# EAGLE design schematic-version4 - Jingbin (EAGLE 8.6.0)
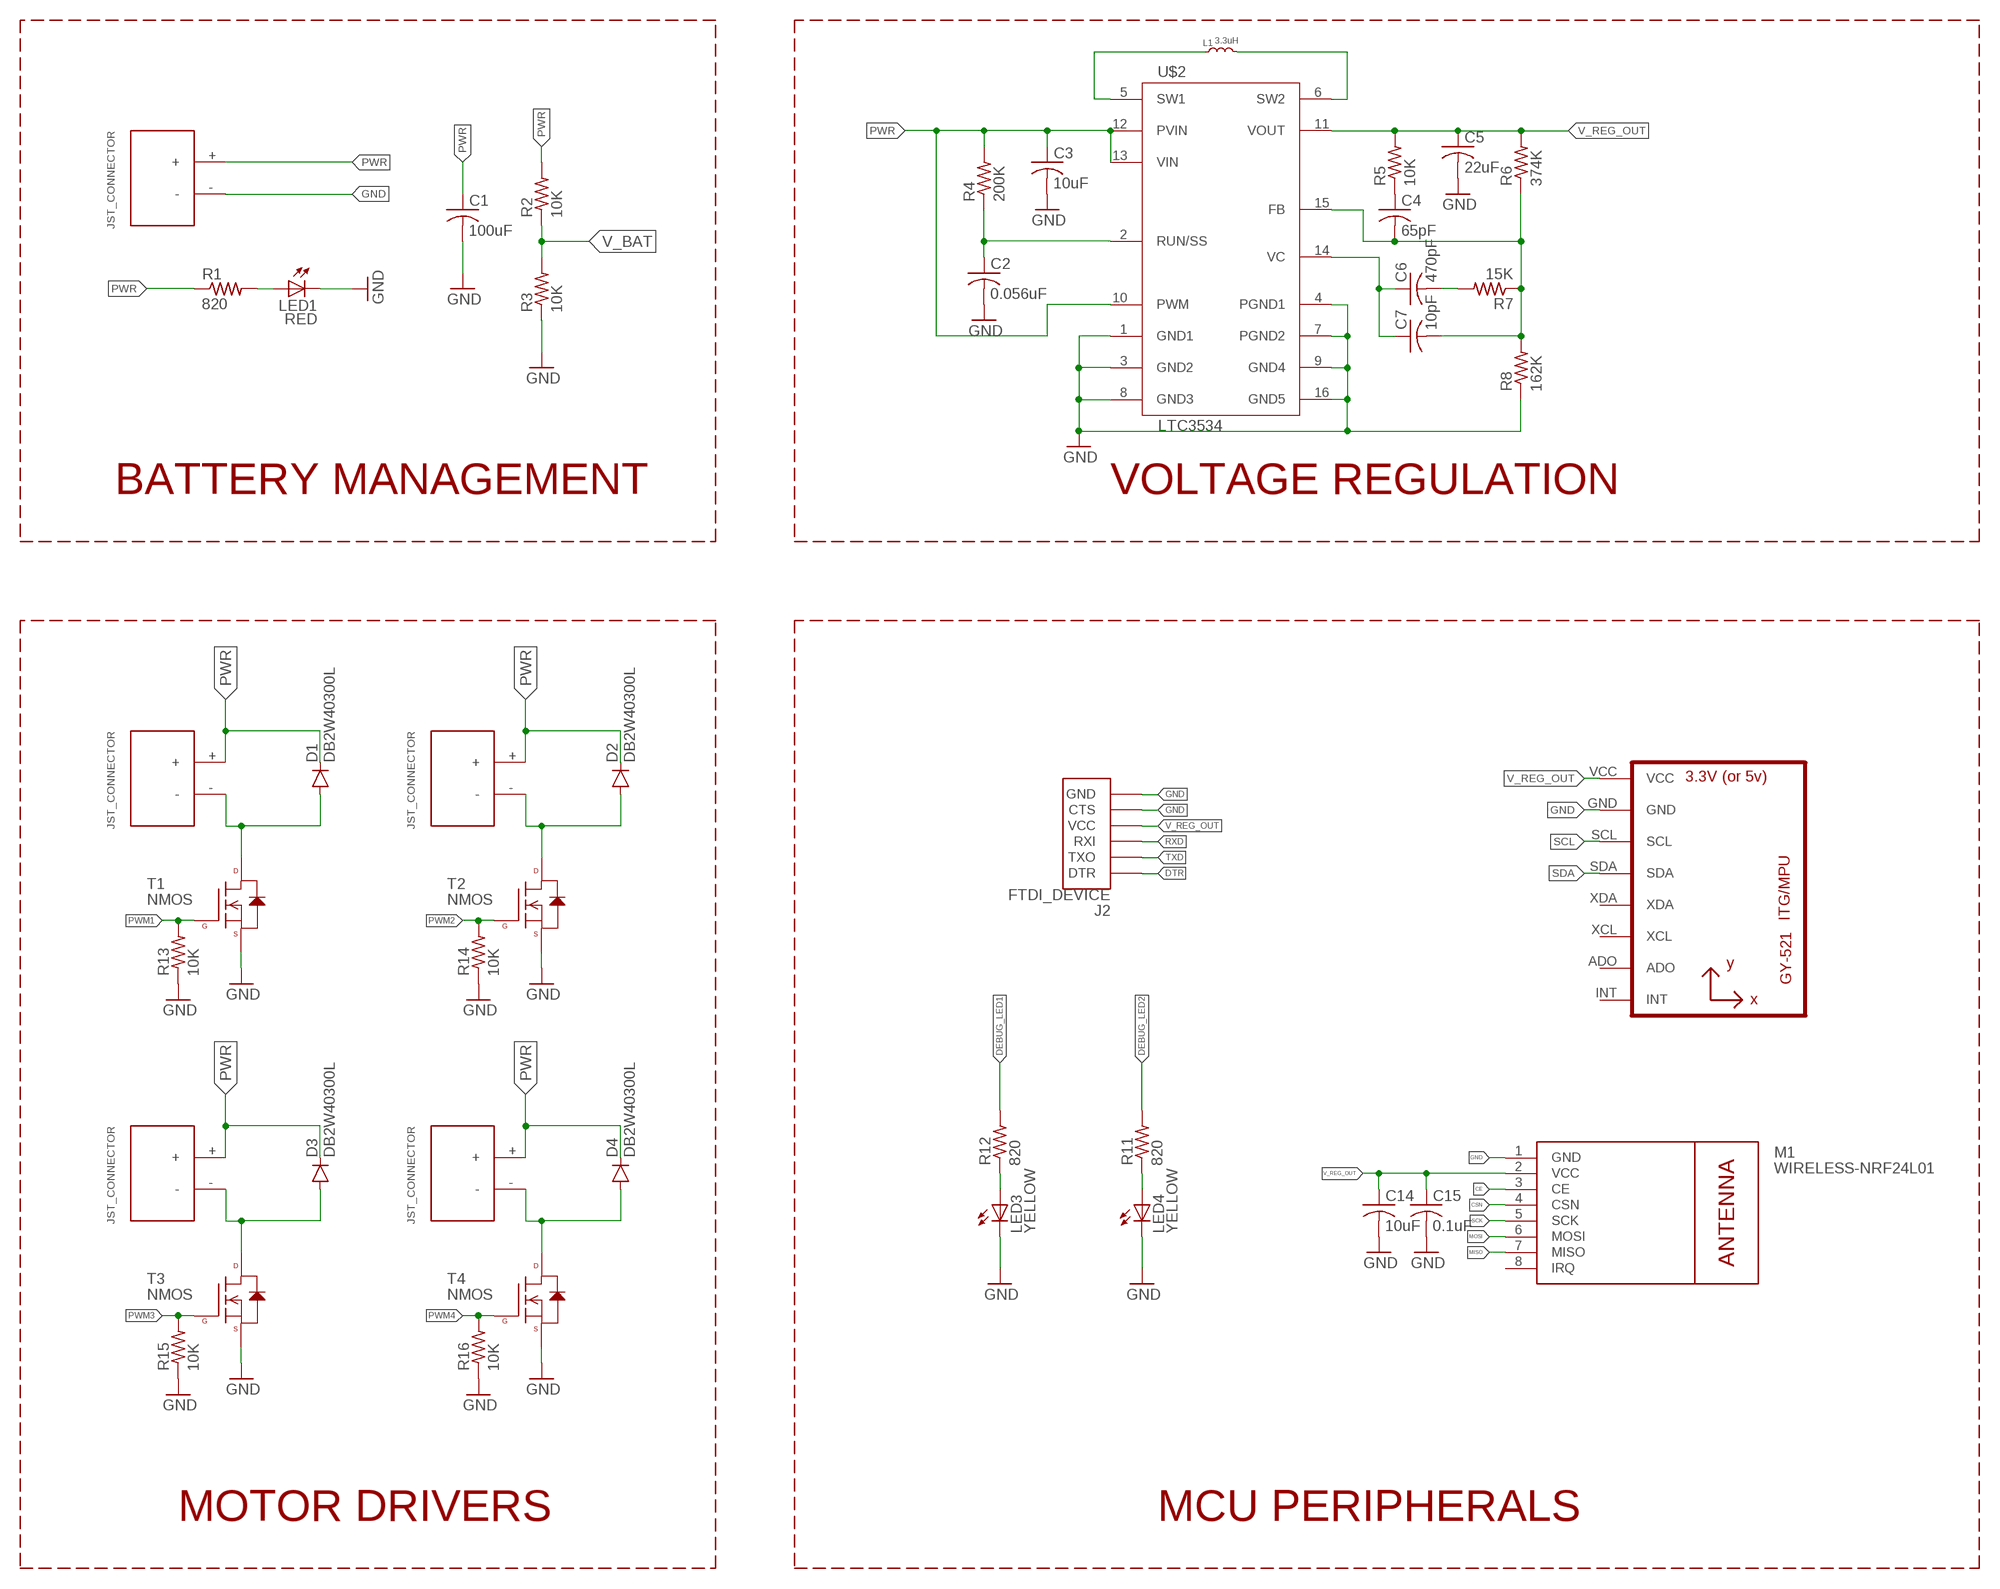
[diagram p0: schematic, sheet 1, part 1 of 2]
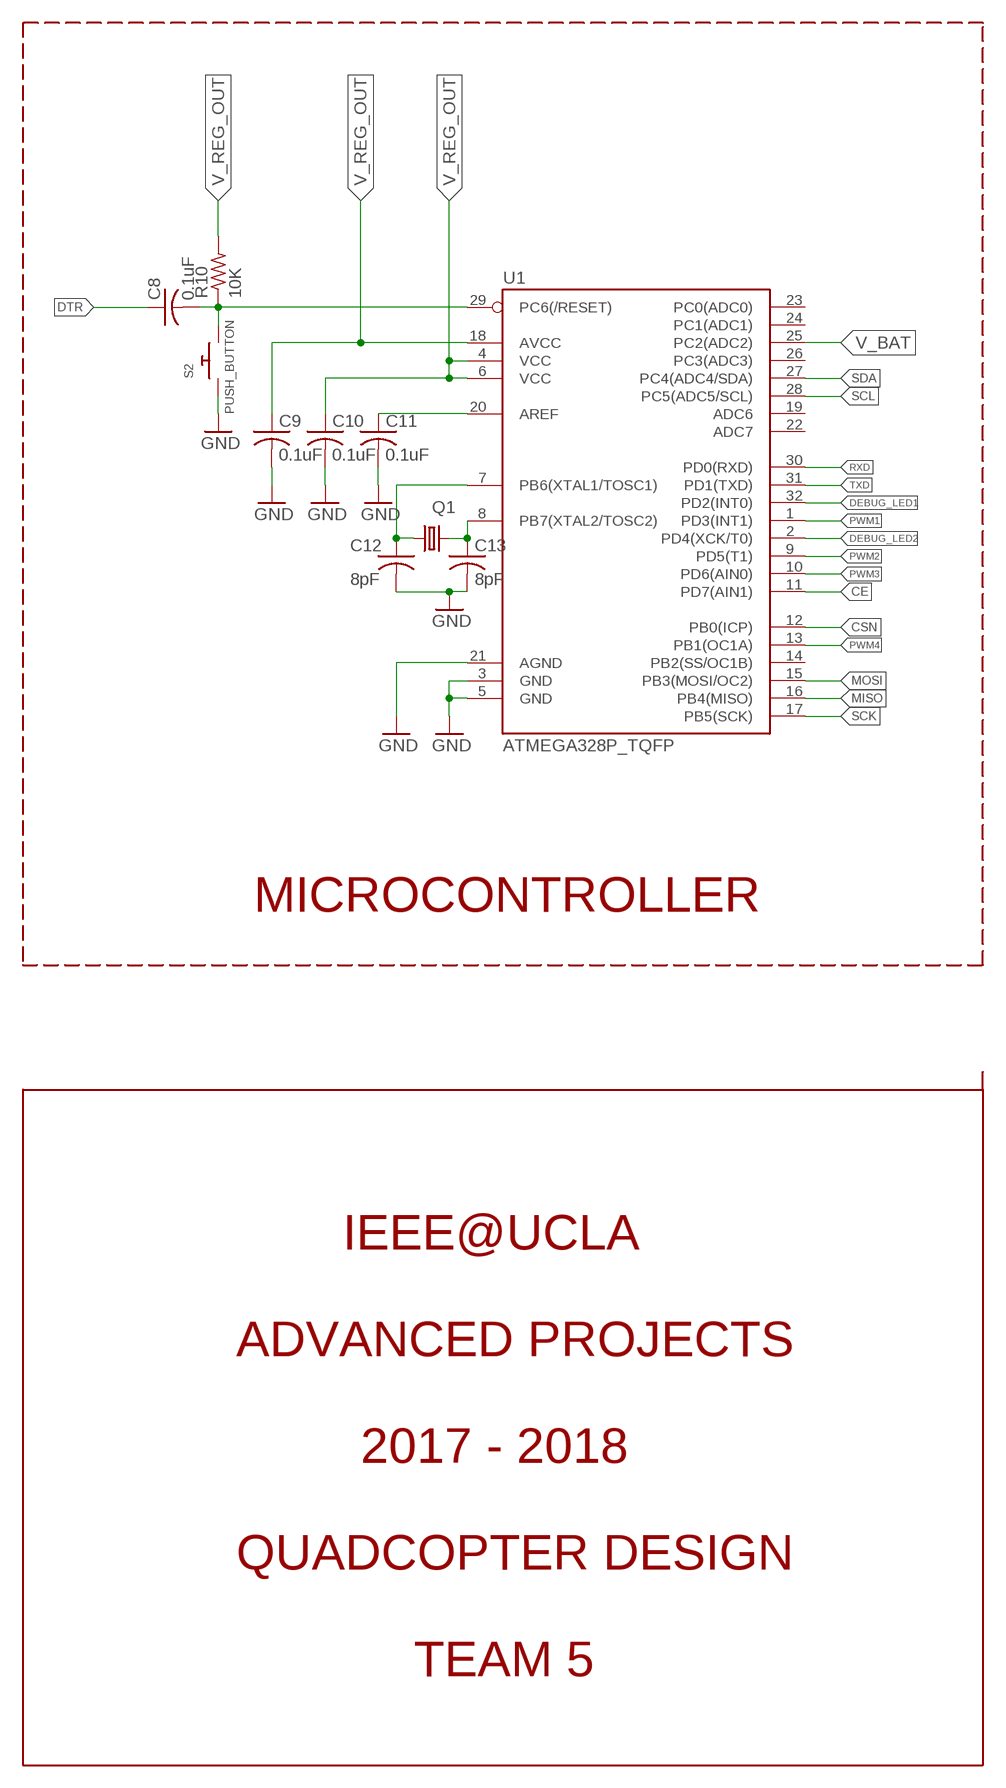
[diagram p1: schematic, sheet 1, part 2 of 2]

## Parts
C1  100uF  C-USC1206  [C1206]
C2  0.056uF  C-USC0603  [C0603]
C3  10uF  C-USC0603  [C0603]
C4  65pF  C-USC1206  [C1206]
C5  22uF  C-USC0603  [C0603]
C6  470pF  C-USC0603  [C0603]
C7  10pF  C-USC0603  [C0603]
C8  0.1uF  C-USC0603  [C0603]
C9  0.1uF  C-USC0603  [C0603]
C10  0.1uF  C-USC0603  [C0603]
C11  0.1uF  C-USC0603  [C0603]
C12  8pF  C-USC0603  [C0603]
C13  8pF  C-USC0603  [C0603]
C14  10uF  C-USC0603  [C0603]
C15  0.1uF  C-USC0603  [C0603]
D1  DB2W40300L  [MINI2-F3-B]
D2  DB2W40300L  [MINI2-F3-B]
D3  DB2W40300L  [MINI2-F3-B]
D4  DB2W40300L  [MINI2-F3-B]
J2  FTDI_DEVICE  [FTDI_DEVICE_SIDE]
L1  3.3uH  INDUCTOR.XAL4020  [XAL4020]
LED1  RED  LEDSML0603  [SML0603]
LED3  YELLOW  LEDSML0603  [SML0603]
LED4  YELLOW  LEDSML0603  [SML0603]
M1  WIRELESS-NRF24L01  [WIRELESS-NRF24L01]
Q1  NX3225GD  [NX3225GD-CRA-3]
R1  820  R-US_R0603  [R0603]
R2  10K  R-US_R0603  [R0603]
R3  10K  R-US_R0603  [R0603]
R4  200K  R-US_R0603  [R0603]
R5  10K  R-US_R0603  [R0603]
R6  374K  R-US_R0603  [R0603]
R7  15K  R-US_R0603  [R0603]
R8  162K  R-US_R0603  [R0603]
R10  10K  R-US_R0603  [R0603]
R11  820  R-US_R0603  [R0603]
R12  820  R-US_R0603  [R0603]
R13  10K  R-US_R0603  [R0603]
R14  10K  R-US_R0603  [R0603]
R15  10K  R-US_R0603  [R0603]
R16  10K  R-US_R0603  [R0603]
S2  PUSH_BUTTON  SWITCH_PUSHBUTTONSOFTTOUCHSMD_SJ  [PUSHBUTTON_SMD_SJ]
T1  NMOS  N-CHANNEL-MOSFET-IRLML6244TRPBF  [SOT23-3]
T2  NMOS  N-CHANNEL-MOSFET-IRLML6244TRPBF  [SOT23-3]
T3  NMOS  N-CHANNEL-MOSFET-IRLML6244TRPBF  [SOT23-3]
T4  NMOS  N-CHANNEL-MOSFET-IRLML6244TRPBF  [SOT23-3]
U1  ATMEGA328P_TQFP  [TQFP32-08]
U2  GY-521MPU6050  [GY-521]
U$1  JST_CONNECTOR_FEMALE  [JST_CONNECTOR_FEMALE]
U$2  LTC3534  [SSOP-16GN]
U$4  JST_CONNECTOR_FEMALE  [JST_CONNECTOR_FEMALE]
U$7  JST_CONNECTOR_FEMALE  [JST_CONNECTOR_FEMALE]
U$10  JST_CONNECTOR_FEMALE  [JST_CONNECTOR_FEMALE]
U$13  JST_CONNECTOR_FEMALE  [JST_CONNECTOR_FEMALE]

## Nets
CE: M1.3(CE) U1.11(PD7(AIN1))
CSN: M1.4(CSN) U1.12(PB0(ICP))
DEBUG_LED1: R12.2 U1.32(PD2(INT0))
DEBUG_LED2: R11.2 U1.2(PD4(XCK/T0))
DTR: C8.1 J2.P$1(DTR)
GND: C1.2 C2.2 C3.2 C5.2 C9.2 C10.2 C11.2 C12.2 C13.2 C14.2 C15.2 J2.P$5(CTS) J2.P$6(GND) LED1.C LED3.C LED4.C M1.1(GND) R3.1 R8.1 R13.1 R14.1 R15.1 R16.1 S2.P$1 T1.2(S) T2.2(S) T3.2(S) T4.2(S) U1.3(GND) U1.5(GND) U1.21(AGND) U2.GND U$1.- U$2.1(GND1) U$2.3(GND2) U$2.4(PGND1) U$2.7(PGND2) U$2.8(GND3) U$2.9(GND4) U$2.16(GND5)
MISO: M1.7(MISO) U1.16(PB4(MISO))
MOSI: M1.6(MOSI) U1.15(PB3(MOSI/OC2))
N$1: C12.1 Q1.P$1 U1.7(PB6(XTAL1/TOSC1))
N$2: C8.2 R10.1 S2.P$2 U1.29(PC6(/RESET))
N$3: D1.POS(PPIN) T1.3(D) U$4.-
N$4: C13.1 Q1.P$2 U1.8(PB7(XTAL2/TOSC2))
N$5: D2.POS(PPIN) T2.3(D) U$7.-
N$6: D3.POS(PPIN) T3.3(D) U$10.-
N$7: D4.POS(PPIN) T4.3(D) U$13.-
N$8: L1.1 U$2.5(SW1)
N$9: L1.2 U$2.6(SW2)
N$10: LED1.A R1.2
N$12: LED3.A R12.1
N$13: LED4.A R11.1
N$14: C4.1 R5.1
N$16: C2.1 R4.1 U$2.2(RUN/SS)
N$18: C4.2 C7.2 R6.1 R7.1 R8.2 U$2.15(FB)
N$19: C6.1 C7.1 U$2.14(VC)
N$20: C6.2 R7.2
N$25: C11.1 U1.20(AREF)
PWM1: R13.2 T1.1(G) U1.1(PD3(INT1))
PWM2: R14.2 T2.1(G) U1.9(PD5(T1))
PWM3: R15.2 T3.1(G) U1.10(PD6(AIN0))
PWM4: R16.2 T4.1(G) U1.13(PB1(OC1A))
PWR: C1.1 C3.1 D1.NEG(GPIN) D2.NEG(GPIN) D3.NEG(GPIN) D4.NEG(GPIN) R1.1 R2.2 R4.2 U$1.+ U$2.10(PWM) U$2.12(PVIN) U$2.13(VIN) U$4.+ U$7.+ U$10.+ U$13.+
RXD: J2.P$3(RXI) U1.30(PD0(RXD))
SCK: M1.5(SCK) U1.17(PB5(SCK))
SCL: U1.28(PC5(ADC5/SCL)) U2.SCL
SDA: U1.27(PC4(ADC4/SDA)) U2.SDA
TXD: J2.P$2(TXO) U1.31(PD1(TXD))
V_BAT: R2.1 R3.2 U1.25(PC2(ADC2))
V_REG_OUT: C5.1 C9.1 C10.1 C14.1 C15.1 J2.P$4(VCC) M1.2(VCC) R5.2 R6.2 R10.2 U1.4(VCC) U1.6(VCC) U1.18(AVCC) U2.VCC U$2.11(VOUT)
Unconnected: M1.8(IRQ) U1.14(PB2(SS/OC1B)) U1.19(ADC6) U1.22(ADC7) U1.23(PC0(ADC0)) U1.24(PC1(ADC1)) U1.26(PC3(ADC3)) U2.ADO U2.INT U2.XCL U2.XDA

## Notes on the sheet
- BATTERY MANAGEMENT | VOLTAGE REGULATION
- MICROCONTROLLER
- IEEE@UCLA
- ADVANCED PROJECTS
- 2017 - 2018
- QUADCOPTER DESIGN
- TEAM 5
- MOTOR DRIVERS | MCU PERIPHERALS

## Library data of the parts
C1 C4 C8-C11 = rcl:C-US: CAPACITOR, American symbol; SPICEPREFIX: C
C2 C3 C5-C7 C12-C15 = resistor:C-US: CAPACITOR, American symbol
D1-D4 = quad:DB2W40300L
J2 = quad:FTDI_DEVICE: Connector which mates to FTDI basic or FTDI cable.
L1 = coilcraft:INDUCTOR
LED1 LED3 LED4 = led:LED: LED OSRAM: - CHIPLED LG R971, LG N971, LY N971, LG Q971, LY Q971, LO R971, LY R971 LH N974, LH R974 LS Q976, LO Q976, LY Q976 LO Q996 - Hyper CHIPLED LW Q18S LB Q993, LB Q99A, LB R99A - SideLED LS A670, LO A670, LY A670, LG A670, LP A670 LB A673, LV A673, LT A673, LW A673 LH A674 LY A675 LS A676, LA A676, LO A676, LY A676, LW A676 LS A679, LY A679, LG A679 - Hyper Micro SIDELED® LS Y876, LA Y876, LO Y876, LY Y876 LT Y87S - SmartLED LW L88C, LW L88S LB L89C, LB L89S, LG L890 LS L89K, LO L89K, LY L89K LS L896, LA L896, LO L896, LY L896 - TOPLED LS T670, LO T670, LY T670, LG T670, LP T670 LSG T670, LSP T670, LSY T670, LOP T670, LYG T670 LG T671, LOG T671, LSG T671 LB T673, LV T673, LT T673, LW T673 LH T674 LS T676, LA T676, LO T676, LY T676, LB T676, LH T676, LSB T676, LW T676 LB T67C, LV T67C, LT T67C, LS T67K, LO T67K, LY T67K, LW E67C LS E67B, LA E67B, LO E67B, LY E67B, LB E67C, LV E67C, LT E67C LW T67C LS T679, LY T679, LG T679 LS T770, LO T770, LY T770, LG T770, LP T770 LB T773, LV T773, LT T773, LW T773 LH T774 LS E675, LA E675, LY E675, LS T675 LS T776, LA T776, LO T776, LY T776, LB T776 LHGB T686 LT T68C, LB T68C - Hyper Mini TOPLED® LB M676 - Mini TOPLED Santana® LG M470 LS M47K, LO M47K, LY M47K Source: http://www.osram.convergy.de LUXEON: - LUMILED® LXK2-PW12-R00, LXK2-PW12-S00, LXK2-PW14-U00, LXK2-PW14-V00 LXK2-PM12-R00, LXK2-PM12-S00, LXK2-PM14-U00 LXK2-PE12-Q00, LXK2-PE12-R00, LXK2-PE12-S00, LXK2-PE14-T00, LXK2-PE14-U00 LXK2-PB12-K00, LXK2-PB12-L00, LXK2-PB12-M00, LXK2-PB14-N00, LXK2-PB14-P00, LXK2-PB14-Q00 LXK2-PR12-L00, LXK2-PR12-M00, LXK2-PR14-Q00, LXK2-PR14-R00 LXK2-PD12-Q00, LXK2-PD12-R00, LXK2-PD12-S00 LXK2-PH12-R00, LXK2-PH12-S00 LXK2-PL12-P00, LXK2-PL12-Q00, LXK2-PL12-R00 Source: www.luxeon.com KINGBRIGHT: KA-3528ASYC Source: www.kingbright.com
M1 = quad:WIRELESS-NRF24L01: 2.4 GHz Wireless Module based on NRF24L01 chip
Q1 = NDK:NX3225GD
R1 R11 R12 = rcl:R-US_: RESISTOR, American symbol; SPICEPREFIX: R
R2-R8 R10 R13-R16 = resistor:R-US_: RESISTOR, American symbol
S2 = adafruit:SWITCH_PUSHBUTTON: Buttons SOFTTOUCHSMD_SJ - Soft touch temporary push button (Super Junk Akihabara) Compatible with SKPMANE010 [Mouser: 688-SKPMAN] C&K_KSS = Digikey: KSS221GLFS
T1-T4 = quad:N-CHANNEL-MOSFET: N-Channel MOSFET Mode Field Effect Transistor; DATASHEET: http://www.mouser.com/ds/2/196/irlml6244pbf-936666.pdf; MOUSER: 942-IRLML6244TRPBF; URL: http://www.mouser.com/Search/ProductDetail.aspx?R=IRLML6244TRPBFvirtualkey57370000virtualkey942-IRLML6244TRPBF
U1 = quad:ATMEGA328P_TQFP; PROD_ID: IC-09069
U2 = quad:GY-521
U$1 U$4 U$7 U$10 U$13 = quad:JST_CONNECTOR_FEMALE
U$2 = LTC3534:LTC3534

## Board
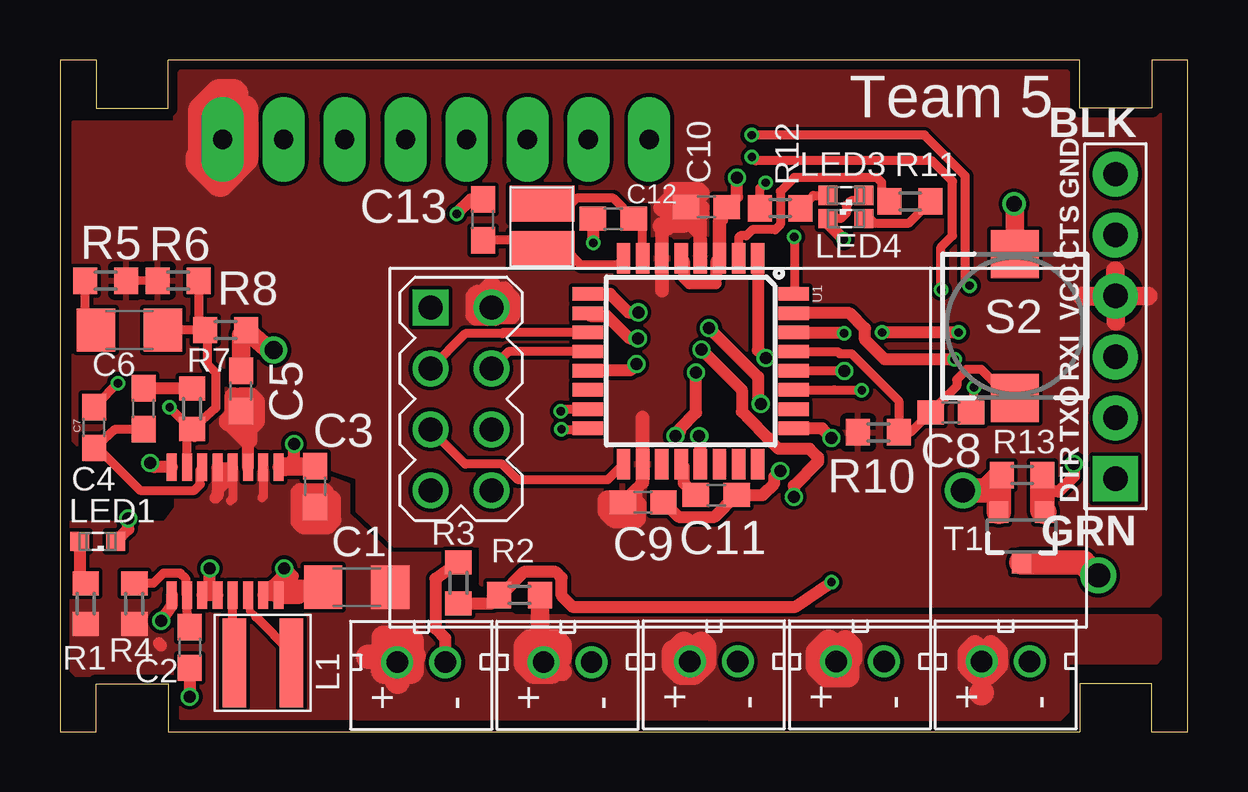
[diagram p2: board, top side]
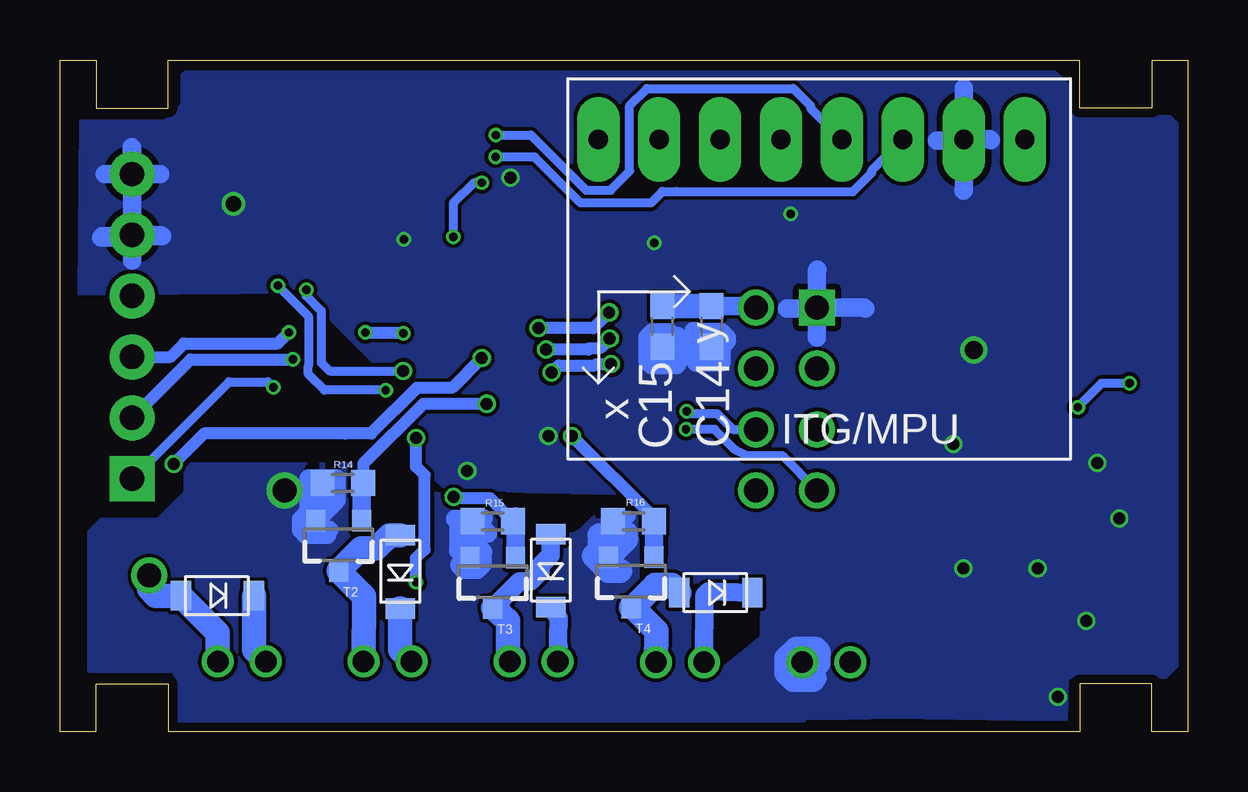
[diagram p3: board, bottom side, seen from below]

Size 47 x 28 mm. Coordinates in mm from the lower left corner, seen from the top.
Outline: 0,0 1.5,0 1.5,2 4.5,2 4.5,0 42.5,0 42.5,2 45.5,2 45.5,0 47,0 47,28 45.5,28 45.5,26 42.5,26 42.5,28 4.5,28 4.5,26 1.5,26 1.5,28 0,28 0,0
Copper layers (1*16): Top 0.035559375mm / dielectric 1.6mm / Bottom 0.035559375mm
Design rules "oshpark-2layer": minimum track width 6mil, minimum drill 10mil, track to track 6mil, track to pad 6mil, pad to pad 6mil, via to via 6mil, smd to smd 6mil, copper to edge 15mil, drill to drill 6mil, minimum pad ring 5mil, minimum via ring 5mil, stop-mask expansion 2.5mil, vias tented up to drill 0mil, thermal gap 10mil

### Footprints (pad centres in the part's own frame; a part is rotated, then mirrored left to right if it is on the bottom)
C1206 = smd 1.6 x 1.8: 1 -1.4,0; 2 1.4,0
C0603 = smd 1.1 x 1: 1 -0.85,0; 2 0.85,0
MINI2-F3-B = smd 1.22 x 0.85: NEG 0,1.55; POS 0,-1.5
FTDI_DEVICE_SIDE = drill 1.016 pad 1.88 square: P$1 -6.35,0 | drill 1.016 pad 1.88: P$2 -3.81,0; P$3 -1.27,0; P$4 1.27,0; P$5 3.81,0; P$6 6.35,0
XAL4020 = smd 0.98 x 3.7: 1 -1.185,0; 2 1.185,0
SML0603 = smd 0.8 x 0.8: A 0.75,0; C -0.75,0
WIRELESS-NRF24L01 = drill 1 square: 1 -12.7,6.35 | drill 1: 2 -10.16,6.35; 3 -12.7,3.81; 4 -10.16,3.81; 5 -12.7,1.27; 6 -10.16,1.27; 7 -12.7,-1.27; 8 -10.16,-1.27
NX3225GD-CRA-3 = smd 1.5 x 2.7: P$1 0.95,0; P$2 -0.95,0
R0603 = smd 1 x 1.1: 1 -0.85,0; 2 0.85,0
PUSHBUTTON_SMD_SJ = smd 2 x 2: P$1 3,0; P$2 -3,0
SOT23-3 = smd 0.8 x 0.9: 1 -0.95,-1; 2 0.95,-1; 3 0,1.1
TQFP32-08 = smd 1.27 x 0.559: 1 -4.293,2.8; 2 -4.293,2; 3 -4.293,1.2; 4 -4.293,0.4; 5 -4.293,-0.4; 6 -4.293,-1.2; 7 -4.293,-2; 8 -4.293,-2.8; 17 4.293,-2.8; 18 4.293,-2; 19 4.293,-1.2; 20 4.293,-0.4; 21 4.293,0.4; 22 4.293,1.2; 23 4.293,2; 24 4.293,2.8 | smd 0.559 x 1.27: 9 -2.8,-4.293; 10 -2,-4.293; 11 -1.2,-4.293; 12 -0.4,-4.293; 13 0.4,-4.293; 14 1.2,-4.293; 15 2,-4.293; 16 2.8,-4.293; 25 2.8,4.293; 26 2,4.293; 27 1.2,4.293; 28 0.4,4.293; 29 -0.4,4.293; 30 -1.2,4.293; 31 -2,4.293; 32 -2.8,4.293
GY-521 = drill 0.8 pad 1.778 long: ADO -8.89,-6.35; GND -8.89,6.35; INT -8.89,-8.89; SCL -8.89,3.81; SDA -8.89,1.27; VCC -8.89,8.89; XCL -8.89,-3.81; XDA -8.89,-1.27
JST_CONNECTOR_FEMALE = drill 0.889: + 0,1; - 0,-1
SSOP-16GN = smd 0.419 x 1.143: 1 -2.223,-2.667; 2 -1.587,-2.667; 3 -0.953,-2.667; 4 -0.318,-2.667; 5 0.318,-2.667; 6 0.953,-2.667; 7 1.587,-2.667; 8 2.223,-2.667; 9 2.223,2.667; 10 1.587,2.667; 11 0.953,2.667; 12 0.318,2.667; 13 -0.318,2.667; 14 -0.953,2.667; 15 -1.587,2.667; 16 -2.223,2.667

### Placement (x,y rotation side)
C1  12.37,6.02 180 top
C2  5.41,3.51 270 top
C3  10.64,10.21 90 top
C4  2.9,16.74 0 top
C5  7.54,14.2 90 top
C6  3.48,13.46 90 top
C7  1.42,12.67 90 top
C8  37.13,13.31 180 top
C9  24.31,9.55 0 top
C10  26.95,21.87 0 top
C11  27.36,9.86 0 top
C12  23.06,21.39 180 top
C13  17.63,21.34 90 top
C14  19.84,16.89 270 bottom
C15  21.89,16.89 270 bottom
D1  40.46,5.66 270 bottom
D2  32.82,6.68 180 bottom
D3  26.54,6.73 180 bottom
D4  19.68,5.79 270 bottom
J2  43.99,16.89 90 top
L1  8.46,2.87 0 top
LED1  1.57,7.92 180 top
LED3  32.77,22.35 180 top
LED4  32.77,21.39 0 top
M1  28.14,11.33 0 top
Q1  20.09,21.06 90 top
R1  1.07,5.34 90 top
R2  19.15,5.69 0 top
R3  16.61,6.2 270 top
R4  3.1,5.33 270 top
R5  1.91,18.8 0 top
R6  4.93,18.8 180 top
R7  5.51,13.46 90 top
R8  6.91,16.74 180 top
R10  34.11,12.47 180 top
R11  35.43,22.1 180 top
R12  30.02,21.82 180 top
R13  40.11,10.69 0 top
R14  35.2,10.36 0 bottom
R15  28.96,8.76 0 bottom
R16  23.09,8.76 0 bottom
S2  39.8,16.92 90 top
T1  40.08,8.15 180 top
T2  35.38,7.8 180 bottom
T3  28.96,6.25 180 bottom
T4  23.19,6.27 180 bottom
U1  26.29,15.44 270 top
U2  15.67,15.8 270 bottom
U$1  15.06,2.9 90 top
U$2  6.88,8.36 0 top
U$4  39.42,2.92 90 top
U$7  33.35,2.92 90 top
U$10  27.25,2.92 90 top
U$13  21.16,2.9 90 top

### Tracks (layer width: path | path; a pad name or v marks a point on that pad's centre or on a via)
CE
  Top 0.381: U1.11 18.49,16.64 18.44,16.59 16.89,16.59 M1.3
CSN
  Top 0.381: U1.12 18.69,15.84 M1.4
DEBUG_LED1  (via drill 0.35)
  Top 0.381: R12.2 29.17,22.64 v29.41,22.89 | v30.61,20.62 30.61,18.27 U1.32
  Bottom 0.381: v29.41,22.89 29.74,22.89 30.61,22.02 v30.61,20.62
DEBUG_LED2
  Top 0.381: R11.2 34.26,22.42 34.26,22.89 34.06,23.09 30.61,23.09 30.03,22.51 30.03,21.14 29.82,20.93 28.86,20.93 28.61,20.68 28.37,20.68 28.29,20.59 U1.2
DTR  (via drill 0.35)
  Top 0.381: C8.1 38.1,13.43 v38.1,14.35
  Bottom 0.381: v38.1,14.35 38.33,14.58 39.95,14.58 J2.P$1
GND  (via drill 0.35, 0.5, 0.65, 0.75, 1)
  Top 0.152: C1.2 10.08,6.02 10.03,6.07
  Top 0.381: LED3.C 33.29,22.13 32.97,22.13 32.77,21.93 32.77,21.61 32.55,21.39 LED4.C
  Top 0.508: U$1.- 16.06,3.89 15.65,4.29 15.65,6.37 R3.1 | C2.2 v5.41,1.45 | U$2.1 4.66,5.27 v4.22,4.62 | LED1.C 2.85,8.45 v2.85,8.89 | U$2.16 3.94,11.02 v3.76,11.2 | U$2.3 6.25,5.69 | 6.25,5.69 U$2.4 | U$2.8 U$2.7 9.4,6.62 v9.35,6.81 | 6.25,5.69 v6.25,6.81 | 9.7,6.48 v9.35,6.81 | v9.35,6.81 9.5,6.68 9.5,6.07 | 9.5,6.07 9.5,5.69 | 10.31,6.07 10.03,6.07 9.5,6.07 | 9.37,11.02 U$2.9 | 9.41,11.06 9.75,11.4 v9.75,11.99 | v30.02,10.87 29.77,10.62 29.77,10.35 29.28,9.86 C11.2 27.3,8.95 25.79,8.95 25.19,9.55 C9.2 | U1.21 26.69,12.28 v26.64,12.32 | 27.49,21.74 C10.2 28.22,22.29 v28.22,23.09 | C12.2 22.21,20.51 v22.23,20.37 | C13.2 17.13,22.19 v16.54,21.59 | LED4.C 32.02,21.17 v32.66,20.52 | U1.5 26,19.62 26,18.93 26.24,18.69 27.33,18.69 27.33,18.89 27.38,18.93 27.38,19.62 U1.3
  Top 0.559: U1.3 27.49,21.25 27.51,21.28 | 27.51,21.28 27.51,21.74 27.52,21.74 | C10.2 27.57,21.64 27.57,21.34 27.51,21.28
  Top 0.762: S2.P$1 39.8,21.97 v39.78,22 | 7.64,16.42 R8.1 | R8.1 8.78,15.85 v8.91,15.9 | C5.2 7.54,16.52 R8.1 | U$2.8 9.5,5.69 9.93,5.69 | C3.2 9.41,11.06 9.37,11.02
  Top 1.016: T1.2 39.13,10.57 R13.1 38.62,10.06 v37.64,10.06
  Bottom 0.508: R16.1 23.73,8.97 23.24,8.97
  Bottom 0.762: 45.14,23.24 J2.P$6 | J2.P$6 43.99,24.33 44.02,24.36 44.02,23.27 J2.P$6 | 42.82,23.24 J2.P$6 | J2.P$6 J2.P$5 | J2.P$5 42.8,20.7 42.75,20.65 45.24,20.65 45.29,20.6 44.09,20.6 J2.P$5 | J2.P$5 43.99,19.63 | T2.2 35.47,9.66 35.47,10.55 36.63,10.55 36.63,9.17 36.96,8.84 36.96,8.41 36.75,8.2 35.87,8.2 35.87,8.33 35.79,8.41 | T3.2 29.5,7.35 29.39,7.47 | 29.39,7.47 29.36,7.49 29.95,8.08 29.95,8 30.38,7.57 | 29.39,7.47 29.39,6.96 29.62,6.73 30.15,6.73 30.35,6.93 30.35,6.96 | U2.GND 9.32,26.82 | U2.GND 8.23,24.69 8.2,24.66 | U2.GND 9.37,24.64 10.44,24.64 | U2.GND 9.32,22.58 9.35,22.55 | M1.1 15.44,19.23 15.42,19.25 | M1.1 13.49,17.68 13.44,17.63 | M1.1 15.44,16.42 | M1.1 15.49,17.63 16.69,17.63 | 30.38,7.57 30.4,7.54 | 30.38,7.57 30.38,8.72 30.53,8.87 30.21,8.87 30.2,8.88 29.34,8.88 29.46,8.76 R15.1 29.67,8.76 29.16,8.26 | C15.2 21.59,16.35 21.59,16.64 22.3,16.64 22.5,16.43 22.5,15.44 22.35,15.29 21.31,15.29 21.26,15.34 21.26,16.48 | C14.2 20.13,16.33 20.5,16.33 20.5,15.39 19.43,15.39 19.43,16.08 19.2,16.31 19.2,16.4 19.46,16.66 20.56,16.66 20.59,16.69 20.6,16.69
  Bottom 1.016: T2.2 36.33,10.09 R14.1 | 24.7,7.27 T4.2 23.41,8.01 23.41,8.26 23.48,8.18 24.51,8.18 24.49,8.15 24.49,7.57 24.74,7.32 24.7,7.27 | 24.7,7.27 24.13,6.71 23.65,6.71 | U$1.- 16.04,2.87 15.39,2.87 15.39,3.33 15.52,3.45 16.31,3.45 16.71,3.05 16.71,2.44 16.43,2.16 15.62,2.16 15.54,2.23
  pour Bottom: 42.04,0.41 42.29,0.66 42.29,2.31 42.19,2.41 42.29,2.51 45.8,2.51 45.8,8.33 45.29,8.84 42.93,8.84 41.78,9.98 41.78,10.9 41.53,11.15 32.72,11.15 31.6,10.03 30.58,9.7 29.82,9.73 28.93,9.73 28.55,9.35 28.55,8.66 28.3,8.23 25.6,8.23 25.3,8.41 24.66,9.04 24.51,9.09 24.16,9.12 22.91,9.14 22.91,6.17 22.45,5.71 20.73,5.71 20.68,5.77 20.27,5.36 20.27,2.95 19.74,2.95 19.48,2.69 19.3,2.69 17.4,4.24 16.71,4.55 16.66,4.5 15.37,4.5 15.42,2.18 15.85,0.76 16,0.38 17.17,0.33
  pour Bottom: 17.73,6.12 17.78,0.56 14.25,0.56 12.24,0.58 7.11,0.51 5.05,0.48 5,2.26 0.91,2.26 0.41,2.77 0.41,25.32 0.71,25.63 4.67,25.63 4.67,26.64 5.51,27.48 41.81,27.48 41.91,27.38 41.91,26.16 42.62,25.45 46.13,25.45 46.2,18.24 44.78,18.26 36.8,18.31 34.92,16.38 33.15,14.66 31.93,14.66 31.93,13.67 32.28,13.72 32.28,13.03 32.31,11.33 30.91,10.11 29.62,10.11 27.58,10.01 22.83,9.91 21.56,8.31 21.59,6.27
MISO  (via drill 0.35)
  Top 0.381: v20.9,12.6 21.95,12.6 U1.16
  Bottom 0.381: M1.7 16.89,11.51 18.44,11.51 18.47,11.54 18.86,11.75 19.71,12.6 v20.9,12.6
MOSI  (via drill 0.35)
  Top 0.381: U1.15 20.97,13.44 v20.88,13.36
  Bottom 0.381: M1.6 18.96,12.6 19.6,13.24 20.77,13.24 v20.88,13.36
N$1
  Top 0.381: U1.7 24.29,21.01 C12.1 23.07,22.23 21.52,22.23 21.3,22.01 Q1.P$1
N$2
  Top 0.381: 38.96,13.92 S2.P$2 39.58,13.92 38.4,15.1 37.8,15.1 37.38,14.68 37.38,14.4 C8.2 35.45,12.47 R10.1 34.96,13.78 32.99,15.76 32.51,15.76 32.42,15.84 U1.29
N$3  (via drill 1)
  Top 1.016: T1.3 42.65,7.05 42.65,7.03 43.18,6.5 v43.28,6.5
  Bottom 1.016: U$4.- 40.42,4.12 D1.POS 43,5.66 43.28,5.94 v43.28,6.5
N$4
  Top 0.381: U1.8 23.21,19.46 21.72,19.46 21.07,20.11 Q1.P$2 19.71,20.49 C13.1
N$5
  Bottom 1.016: U$7.- 34.33,5.64 T2.3 34.45,7.63 33.82,7.63 33.27,8.18 D2.POS
N$6
  Bottom 0.762: D3.POS 26.54,7.34 26.96,6.92 26.96,6.68 27.39,6.26 27.84,6.26 T3.3
  Bottom 1.016: U$10.- 28.09,3.06 28.32,3.28 28.32,4.62 T3.3 28.73,5.15
N$7
  Bottom 1.016: T4.3 23.11,5.17 | 23.11,5.17 22.13,4.19 U$13.- | 23.11,5.17 22.2,6.09 22.2,6.11 21.5,6.11 D4.POS
N$8
  Top 0.381: L1.1 7.2,3.17 U$2.5
N$9
  Top 0.305: U$2.6 7.91,5.61 7.91,5.04 8.18,4.77
  Top 0.381: L1.2 9.64,3.31 8.18,4.77
N$10
  Top 0.508: LED1.A 0.82,6.43 R1.2
N$12
  Top 0.381: R12.1 31.41,22.35 LED3.A
N$13
  Top 0.381: LED4.A 33.76,21.39 33.94,21.2 35.39,21.2 R11.1
N$14
  Top 0.381: C4.1 1.05,17.18 R5.1
N$16
  Top 0.381: R4.1 3.89,6.18 4.31,6.6 5.01,6.6 5.26,6.36 5.26,5.73 U$2.2 5.3,5.03 C2.1
N$18  (via drill 0.35)
  Top 0.381: 5.61,12.26 R7.1 | R7.1 6.51,13.51 6.51,14.95 6.16,15.3 6.16,16.64 R8.2 | v2.41,14.53 1.55,13.66 C7.2 | R8.2 C4.2 | R6.1 5.78,17.02 R8.2 | R7.1 5.47,12.61 v4.57,13.51 | U$2.15 5.3,12.4 R7.1
  Bottom 0.381: v2.41,14.53 3.58,14.53 4.57,13.54 v4.57,13.51
N$19
  Top 0.381: C6.1 2.31,12.61 C7.1 1.57,11.82 3.34,10.06 5.6,10.06 5.85,10.31 5.85,10.94 U$2.14
N$20
  Top 0.508: R7.2 C6.2
N$25
  Top 0.508: U1.20 26,11.04 26,10.35 26.24,10.11 26.25,10.11 C11.1
PWM1  (via drill 0.5)
  Top 0.508: U1.1 29.09,15.9 v29.42,15.57 | v42.27,11.15 42.27,10.64 42.22,10.59 41.63,10.01 40.96,10.01
  Top 1.016: R13.2 40.96,10.01 40.96,9.23 T1.1
  Bottom 0.508: v29.42,15.57 30.66,14.33 32.12,14.33 34.03,12.42 35.1,12.42 41,12.42 v42.27,11.15
PWM2  (via drill 0.5)
  Top 0.508: v29.21,13.66 29.09,13.66 29.09,14.78 v27.06,16.82 | U1.9 22.93,18.24 23.7,17.48 v24.11,17.48
  Bottom 0.508: v29.21,13.66 31.85,13.66 34.35,11.16 R14.2 | v24.11,17.48 24.76,16.82 v27.06,16.82
  Bottom 0.762: T2.1 34.43,10.29 R14.2
PWM3  (via drill 0.5)
  Top 0.508: v30.59,9.78 30.59,10.24 31.6,11.25 31.6,11.43 31.24,11.79 29.95,11.79 29.54,12.2 29.54,12.23 28.68,13.09 | 28.68,13.09 28.43,13.34 28.43,14.24 v26.75,15.93 | 28.68,13.08 28.68,13.09 | U1.10 22.11,17.33 22.8,17.33 23.74,16.39 v24.09,16.39
  Bottom 0.508: 28.01,8.96 R15.2 | 30.61,9.8 v30.59,9.78 30.53,9.72 29.06,9.72 R15.2 | T3.1 28.01,8.66 R15.2 | v24.09,16.39 24.5,15.98 24.93,15.98 24.98,15.93 v26.75,15.93
  Bottom 0.762: T3.1 28.01,8.96
PWM4  (via drill 0.5)
  Top 0.508: v25.66,12.32 25.86,12.52 25.86,12.64 26.52,13.3 v26.52,14.96 | U1.13 22.02,15.06 23.77,15.06 v24.03,15.32
  Bottom 0.508: v25.66,12.32 22.24,8.92 R16.2 T4.1 | v26.52,14.96 26.21,15.27 24.71,15.27 24.66,15.32 v24.03,15.32
  Bottom 0.762: T4.1 22.24,8.92
PWR
  Top 0.381: U$2.10 8.47,9.82 8.41,9.75 | 7.11,9.63 7.2,9.72 U$2.12 6.86,11.02 | 6.86,11.02 U$2.13 | 6.86,11.02 6.86,10.27 6.57,9.98
  Top 0.508: 1.27,4.55 1.28,4.56 R1.1 | 4.12,3.68 4.22,3.58 | U$2.13 6.57,9.98 6.57,9.84 6.48,9.75
  Top 0.762: R2.2 20,3.25 U$13.+ 20.57,2.49 20.96,2.49 | C3.1 10.96,9.68 11.33,9.68 11.33,8.84 11.35,8.81 11.15,8.61 10.16,8.61 9.98,8.79 9.98,9.96 10,9.98 11.02,9.98 | U$4.+ 38.42,3.34 38.12,3.63 37.8,3.3 37.8,2.72 38.18,2.34 38.71,2.34 39.14,2.77 39.14,3.3 38.81,3.63
  Top 1.016: U$1.+ 14.04,3.12 12.85,3.12 | U$1.+ 14.73,3.15 | U$1.+ 14.06,2.09 14.07,2.08 | 32.31,2.94 U$7.+ 32.03,3.37 32.03,3.73 31.6,3.3 31.6,2.72 31.98,2.34 32.82,2.34 32.82,2.95 32.94,3.07 32.94,3.5 32.74,3.71 | 38.42,1.62 38.41,1.6 | U$1.+ 13.49,3.72 13.49,3.91 14.53,3.91 14.66,3.79 14.66,2.54 14.61,2.49 13.51,2.49 13.46,2.54 | U$13.+ 20.18,3.07 20.83,3.07 20.83,3.6 20.68,3.76 19.61,3.76 19.43,3.58 19.43,2.82 19.76,2.49 20.47,2.49 | U$10.+ 26.25,3.41 26.01,3.66 25.68,3.33 25.6,3.33 25.6,2.74 25.91,2.44 26.42,2.44 26.85,2.87 26.85,3.53 26.72,3.66
  Bottom 0.508: 38.91,3.44 38.55,3.07
  Bottom 0.762: 26.23,3.56 U$10.+ 26.23,4.73 D3.NEG | D4.NEG 19.96,5.84 20.13,5.67 U$13.+
  Bottom 1.016: D2.NEG 32.82,3.41 U$7.+ | D1.NEG 38.91,3.44 38.91,3.41 U$4.+
  pour Top (no thermals): 41.68,0.48 42.01,0.81 42.01,2.87 45.72,2.87 45.87,3.02 45.87,4.7 45.75,4.83 18.92,4.85 17.14,5.97 17.12,7.14 17.12,7.42 13.77,7.42 12.04,9.07 12.04,10.31 10.06,11.05 5.16,10.97 4.85,10.67 4.83,9.35 4.37,8.71 0.43,8.74 0.43,2.57 0.66,2.34 4.7,2.34 5.03,2.01 5.03,0.56 12.37,0.53
RXD  (via drill 0.35)
  Top 0.508: v37.47,16.64 v34.27,16.64 | U1.30 32.66,16.64 v32.69,16.61
  Bottom 0.508: J2.P$3 42.39,15.62 41.83,16.18 37.92,16.18 v37.47,16.64 | v34.27,16.64 32.72,16.64 v32.69,16.61
SCK
  Top 0.381: M1.5 16.89,11.15 18.44,11.15 19.1,10.49 22.83,10.49 U1.17
SCL  (via drill 0.35, 0.5)
  Top 0.381: v36.73,18.41 36.73,20.2 37.2,20.67 37.2,22.95 36.35,23.8 29,23.8 v28.84,23.95 | U1.28 v32.68,15.04 v32.69,15.04
  Bottom 0.381: U2.SCL 13.17,23.38 13.17,23.29 13.96,22.5 21.28,22.5 21.29,22.51 21.89,22.51 22.37,22.04 25.29,22.04 27.21,23.95 v28.84,23.95 | v36.73,18.41 36.73,18.15 36.11,17.53 36.11,15.38 35.76,15.04 v32.69,15.04
SDA  (via drill 0.35)
  Top 0.381: v37.92,18.59 37.74,18.78 37.74,23.17 36.03,24.87 v28.83,24.87 | U1.27 32.27,14.24 v33.43,14.23
  Bottom 0.381: v37.92,18.59 37.45,18.12 36.64,17.31 36.64,15.25 36.65,15.24 36.65,14.91 35.97,14.23 v33.43,14.23 | U2.SDA 15.71,26 15.71,26.09 16.43,26.81 22.53,26.81 23.25,26.09 23.25,23.37 24.05,22.57 25.07,22.57 27.37,24.87 v28.83,24.87
TXD  (via drill 0.35)
  Top 0.508: v37.29,15.52 34.38,15.52 33.56,16.34 33.56,16.81 32.92,17.44 U1.31
  Bottom 0.508: J2.P$2 41.55,15.52 v37.29,15.52
V_BAT  (via drill 0.35, 0.5)
  Top 0.508: 18.38,5.69 R2.1 | 18.38,5.69 19.33,6.65 20.67,6.65 20.91,6.41 20.91,5.66 21.36,5.21 30.66,5.21 v32.16,6.22 | R3.2 18.04,5.35 18.38,5.69 | v32.16,12.24 31.76,12.64 U1.25
  Bottom 0.508: v32.16,12.24 32.16,11.05 31.8,10.69 31.8,7.59 32.16,7.23 v32.16,6.22
V_REG_OUT
  Top 0.381: R5.2 2.98,18.82 R6.2 | 7.54,14.13 7.57,14.16
  Top 0.508: U$2.11 7.84,12.15 | 24.29,10.38 24.01,10.1 | 24.01,10.1 C9.1 | 25.09,18.4 25.12,18.36 | 24.29,13.09 24.31,13.11 | 24.03,9.25 24.03,10.08 24.01,10.1 | C10.1 26.83,21.87 26.83,21.86 26.77,21.73 26.83,21.6 26.83,21.57
  Top 0.559: 24.29,10.38 U1.18 24.29,13.09 | 25.09,18.4 U1.6 25.09,21.08 26.01,21.08 26.18,21.25 | U1.4 26.69,20.48 26.68,20.49 26.68,20.75 | 26.68,20.75 26.68,21.66 26.75,21.74 | 26.68,20.75 26.18,21.25 | 26.18,21.25 25.83,21.6
  Top 0.762: J2.P$4 42.62,18.16 42.6,18.14 43.97,18.14 J2.P$4 | 43.99,19.23 J2.P$4 | 45.36,18.16 J2.P$4 | 44.02,17.09 44.02,18.14 J2.P$4 | 6.68,22.94 6.68,24.59 U2.VCC | C5.1 7.25,13.65 7.25,13.77 7.23,13.78 | 7.23,13.78 7.25,13.77 7.23,13.48 7.23,13.18 7.01,12.96 7.01,12.9 7.09,12.9 7.84,12.15 7.84,12.64 8.15,12.95 8.15,13.74 7.93,13.96 7.57,13.96 | 7.23,13.78 7.23,13.96 | 18.52,18.31 18.52,18.39 | 18.52,18.31 18.52,18.21 M1.2 17.98,18.59 17.63,18.24 17.4,18.24 17.27,18.11 17.27,17.39 17.35,17.31 18.14,17.31 18.19,17.37 18.8,17.37 18.8,18.03 18.52,18.31 | C9.1 22.96,9.55 22.84,9.68 22.81,9.65 22.81,9.17 23.11,8.87 24.03,8.87 24.03,9.25 24.07,9.29 24.07,9.45 | 25.09,21.08 25.31,21.08 25.83,21.6 C10.1 26.07,21.84 25.12,21.84 25.55,22.28 25.55,22.53 26.6,22.53 26.7,22.43
  Top 1.27: U2.VCC 7.21,25.12 7.21,26.57 6.66,26.57 5.97,25.88 5.97,24 5.87,23.9 5.87,23.75 6.68,22.94 7.64,23.9 7.64,25.93
  Bottom 0.762: C14.1 18.05,17.74 M1.2
  Bottom 1.016: C15.1 C14.1
  pour Top: 11.48,10.87 12.4,10.57 12.4,9.17 13.92,7.75 17.53,7.72 17.53,6.15 19.18,5.21 19.46,5.23 45.42,5.23 45.87,5.69 45.87,25.76 42.19,25.76 42.04,25.91 42.04,27.48 41.81,27.71 5.21,27.71 4.78,27.28 4.78,25.4 0.56,25.4 0.56,12.12 1.14,11.53 9.19,11.53 9.32,11.66

### Text on the board
tPlace: Team 5
tNames: L1